# Altium project NRF_RHD2132_1813_YBW.PrjPcb
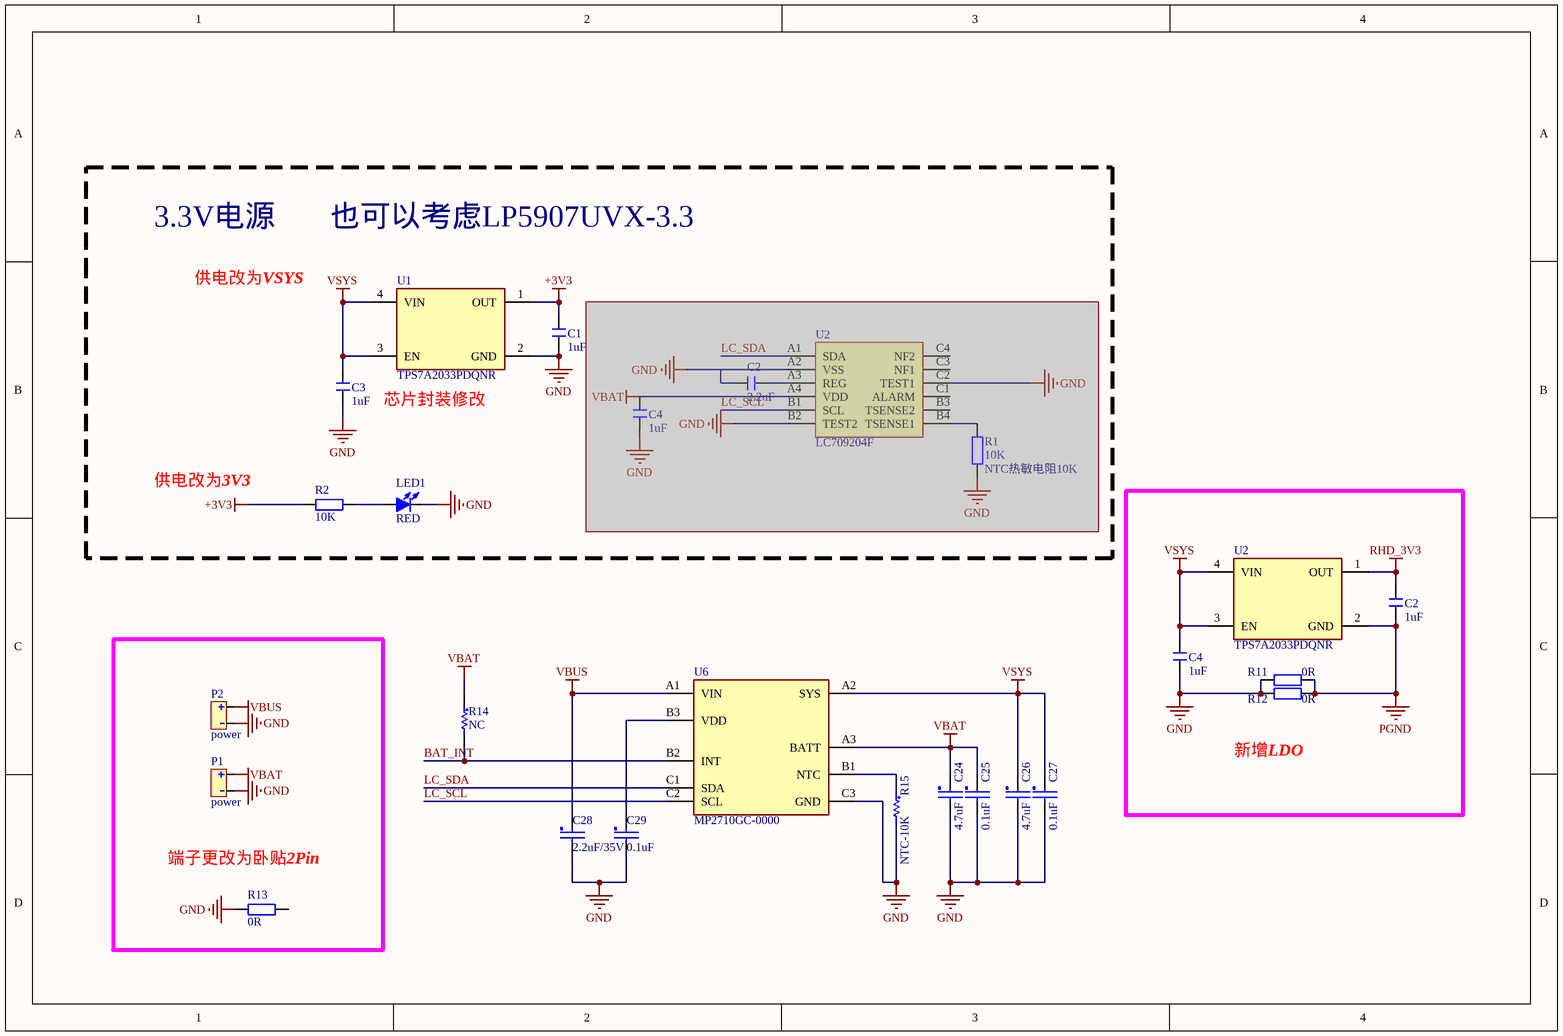
[diagram p0: Power.SchDoc]
4 sheets, 62 parts. Net scope: global (net labels, ports and power ports of the same name join across sheets).
Board file: rhd2132_20250418.PcbDoc
Sheets:
  Power.SchDoc
  rhd2132.SchDoc
  IMU.SchDoc
  nrf52840_wlcsp.SchDoc

## Sheet Power.SchDoc
size A4

### Parts
(Parts that share a designator on the sheet are numbered #1, #2 ... from top to bottom, then left to right.)
C1  1uF  [C 0201_L]
C2#1  2.2uF  [C 0201_L]  (masked out: inside a compile mask, not in the netlist)
C2#2  1uF  [C 0201_L]
C3  1uF  [C 0201_L]
C4#1  1uF  [C 0201_L]  (masked out: inside a compile mask, not in the netlist)
C4#2  1uF  [C 0201_L]
C24  4.7uF  [0201(C)]
C25  0.1uF  [0201(C)]
C26  4.7uF  [0201(C)]
C27  0.1uF  [0201(C)]
C28  2.2uF/35V  [0201(C)]
C29  0.1uF  [0201(C)]
LED1  RED  [LED-SMD_L0.7-W0.4-RD_BLUE - duplicate]
P1  power  [CONN-SMD_SM02B-SURS-TF-LF-SN - duplicate]
P2  power  [HDR-SMD_2P-P1.27-V-M-LS4.2-R1]
R1  10K  BOM名称: NTC热敏电阻10K  [R0201]  (masked out: inside a compile mask, not in the netlist)
R2  10K  [R 0201_L]
R11  0R  [R 0201_L]
R12  0R  [R 0201_L]
R13  0R  [0402(R)]
R14  NC  [0201(R)]  (no BOM)
R15  NTC-10K  [0201(R)]
U1  TPS7A2033PDQNR  [X2SON-0.4]
U2#1  LC709204F  [WLCSP-12_L2.0-W1.5-R3-C4-P0.40-TL]  (masked out: inside a compile mask, not in the netlist)
U2#2  TPS7A2033PDQNR  [X2SON-0.4]
U6  MP2710GC-0000  [WLCSP3*3-P0.5mm]

### Blocks framed on the sheet
新增LDO: C2#2 C4#2 R11 R12 U2#2
端子更改为卧贴2Pin: P1 P2 R13

### Nets
+3V3: C1.2 R2.1 U1.1(OUT)
GND: C1.1 C3.1 C4#2.1 C24.2 C25.2 C26.2 C27.2 C28.2 C29.2 LED1.2(K) P1.1(-) P2.1(-) R11.1 R12.1 R13.1 R15.2 U1.2(GND) U6.C3(GND)
PGND: C2#2.1 R11.2 R12.2 U2#2.2(GND)
RHD_3V3: C2#2.2 U2#2.1(OUT)
VBAT: C24.1 C25.1 P1.2(+) R14.1 U6.A3(BATT)
VBUS: C28.1 P2.2(+) U6.A1(VIN)
VSYS: C3.2 C4#2.2 C26.1 C27.1 U1.3(EN) U1.4(VIN) U2#2.3(EN) U2#2.4(VIN) U6.A2(SYS)
BAT_INT: R14.2 U6.B2(INT)
LC_SCL: U6.C2(SCL)
LC_SDA: U6.C1(SDA)
NetC29_1: C29.1 U6.B3(VDD)
NetLED1_1: LED1.1(A) R2.2
NetR15_1: R15.1 U6.B1(NTC)

Not connected (* = marked no-connect by the designer): R13 2

### Notes on the sheet
- 3.3V电源
- 也可以考虑LP5907UVX-3.3
- 供电改为VSYS
- 芯片封装修改
- 供电改为3V3

### Library data of the parts
C1 C2#1 C2#2 C3 C4#1 C4#2 = C: 贴片电容; BOM名称: 无极性贴片电容
  C1 C2#2 C3 C4#2: Value: 1uF
  C2#1: value: 2.2uF
  C4#1: value: 1uF
C24-C29 = CAP
LED1 = LED-SMD: 贴片LED; BOM名称: 贴片LED; Color: RED
R1 = R: NTC热敏电阻 10K; Value: 10K
R2 = R: 贴片电阻; BOM名称: 贴片电阻; Value: 10K
R11 R12 = R: 贴片电阻; Value: 10K; BOM名称: 贴片电阻
R13 = R: 贴片电阻 OR; Value: 10K; BOM名称: 贴片电阻
R14 R15 = Res Semi: Semiconductor Resistor; Value: 100; Published: 8-Jun-2000; LatestRevisionDate: 17-Jul-2002; LatestRevisionNote: Re-released for DXP Platform.; PackageReference: AXIAL-0.5; Publisher: Altium Limited; PackageDescription: Axial Device, Thru-Hole; 2 Leads; 0.5 in Pin Spacing
U1 U2#2 = IC_TPS7A2033PDQNR: TPS7A2033PDQNR/X2SON
U2#1 = LC709203F
U6 = MP2710

## Sheet rhd2132.SchDoc
size A4
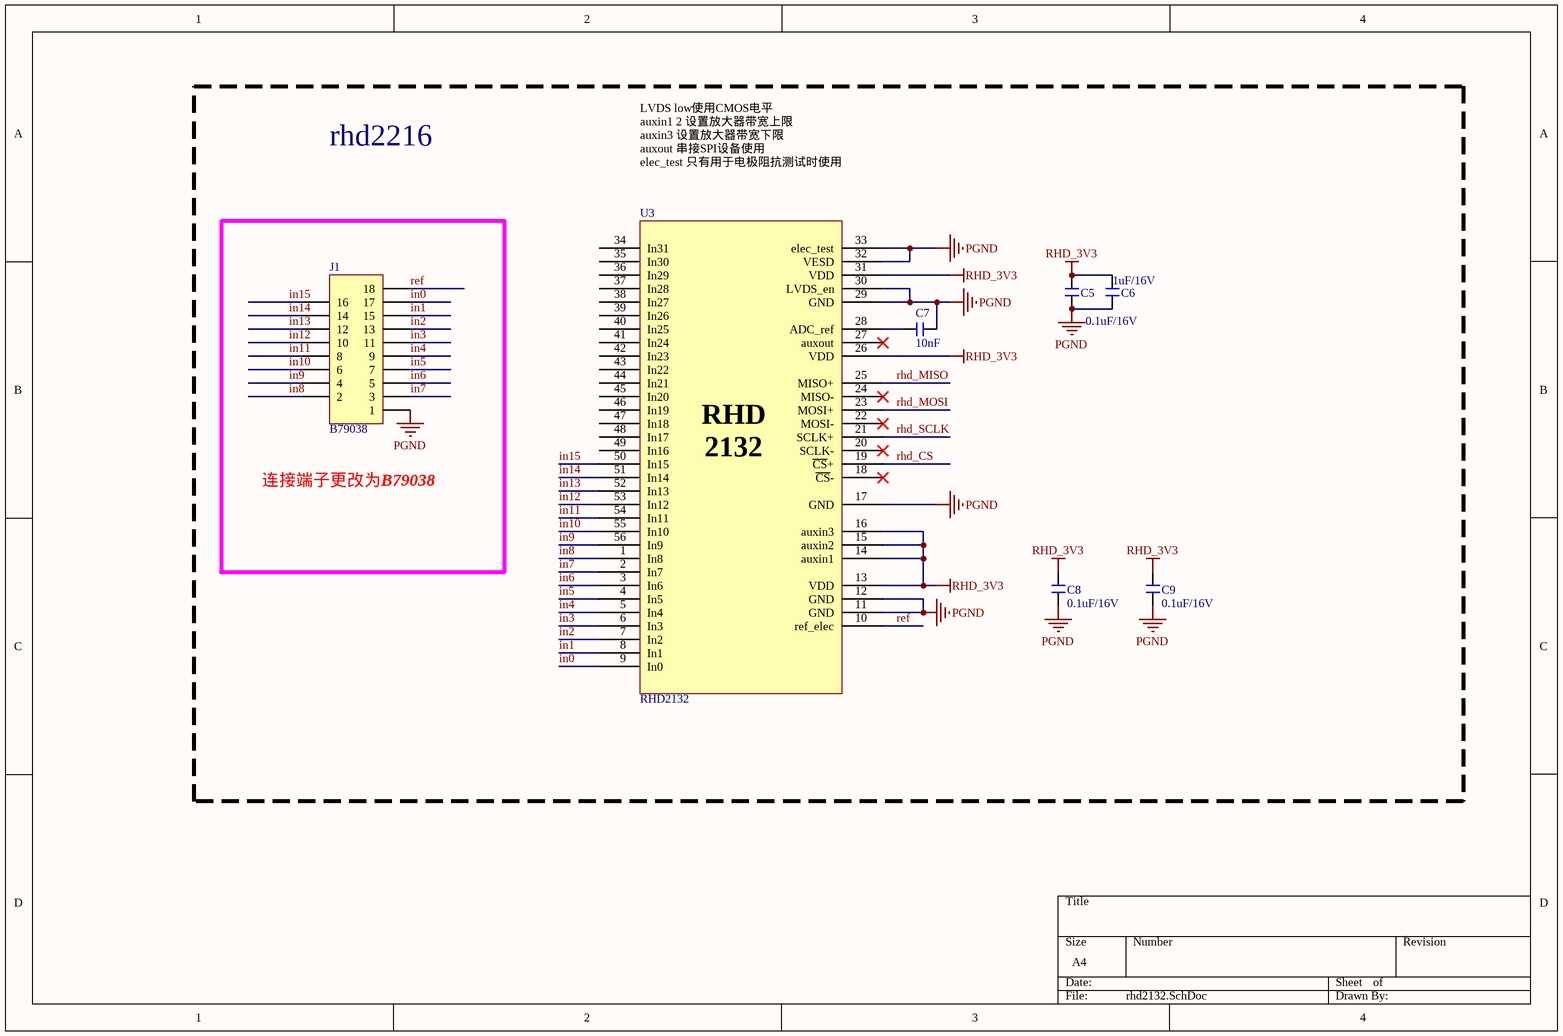
[diagram p1: rhd2132.SchDoc]

### Parts
C5  0.1uF/16V  [C 0201_L]
C6  1uF/16V  [C 0201_L]
C7  10nF  [C 0201_L]
C8  0.1uF/16V  [C 0201_L]
C9  0.1uF/16V  [C 0201_L]
J1  B79038  [B79038]
U3  RHD2132  [QFN-56-9mm]

### Blocks framed on the sheet
rhd2216: C5-C9 U3
连接端子更改为B79038: J1

### Nets
PGND: C5.1 C6.1 C7.2 C8.1 C9.1 J1.1 U3.11(GND) U3.12(GND) U3.17(GND) U3.29(GND) U3.30(LVDS_en) U3.32(VESD) U3.33(elec_test)
RHD_3V3: C5.2 C6.2 C8.2 C9.2 U3.13(VDD) U3.14(auxin1) U3.15(auxin2) U3.16(auxin3) U3.26(VDD) U3.31(VDD)
in0: J1.17 U3.9(In0)
in1: J1.15 U3.8(In1)
in2: J1.13 U3.7(In2)
in3: J1.11 U3.6(In3)
in4: J1.9 U3.5(In4)
in5: J1.7 U3.4(In5)
in6: J1.5 U3.3(In6)
in7: J1.3 U3.2(In7)
in8: J1.2 U3.1(In8)
in9: J1.4 U3.56(In9)
in10: J1.6 U3.55(In10)
in11: J1.8 U3.54(In11)
in12: J1.10 U3.53(In12)
in13: J1.12 U3.52(In13)
in14: J1.14 U3.51(In14)
in15: J1.16 U3.50(In15)
ref: J1.18 U3.10(ref_elec)
rhd_CS: U3.19(~{CS}+)
rhd_MISO: U3.25(MISO+)
rhd_MOSI: U3.23(MOSI+)
rhd_SCLK: U3.21(SCLK+)
NetC7_1: C7.1 U3.28(ADC_ref)

Not connected (* = marked no-connect by the designer): U3 18(~{CS}-)* 20(SCLK-)* 22(MOSI-)* 24(MISO-)* 27(auxout)* 34(In31) 35(In30) 36(In29) 37(In28) 38(In27) 39(In26) 40(In25) 41(In24) 42(In23) 43(In22) 44(In21) 45(In20) 46(In19) 47(In18) 48(In17) 49(In16)

### Notes on the sheet
- LVDS low使用CMOS电平
  auxin1 2 设置放大器带宽上限
  auxin3 设置放大器带宽下限
  auxout 串接SPI设备使用
  elec_test 只有用于电极阻抗测试时使用
  接地电极布于四周
- (in symbol RHD2132) RHD / 2132

### Library data of the parts
C5-C9 = C: 贴片电容; BOM名称: 无极性贴片电容
  C5 C8 C9: Value: 0.1uF/16V
  C6: Value: 1uF/16V
  C7: Value: 10nF
J1 = CON_A79015-001-18PIN: LatestRevisionDate: 17-Jul-2002; LatestRevisionNote: Re-released for DXP Platform.; Publisher: Altium Limited

## Sheet IMU.SchDoc
size A4
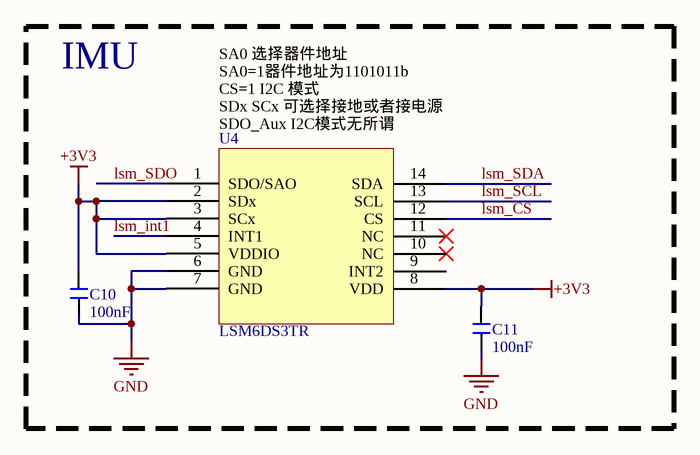
[diagram p2: IMU.SchDoc]

### Parts
C10  100nF  [C 0201_L]
C11  100nF  [C 0201_L]
U4  LSM6DS3TR  [LAG-14]

### Blocks framed on the sheet
IMU: C10 C11 U4

### Nets
+3V3: C10.2 C11.2 U4.2(SDx) U4.3(SCx) U4.5(VDDIO) U4.8(VDD)
GND: C10.1 C11.1 U4.6(GND) U4.7(GND)
lsm_CS: U4.12(CS)
lsm_int1: U4.4(INT1)
lsm_SCL: U4.13(SCL)
lsm_SDA: U4.14(SDA)
lsm_SDO: U4.1(SDO/SAO)

Not connected (* = marked no-connect by the designer): U4 9(INT2) 10(NC)* 11(NC)*

### Notes on the sheet
- (near U4) SA0 选择器件地址
  SA0=1器件地址为1101011b
  CS=1 I2C 模式
  SDx SCx 可选择接地或者接电源
  SDO_Aux I2C模式无所谓

### Library data of the parts
C10 C11 = C: 贴片电容; BOM名称: 无极性贴片电容; value: 100nF

## Sheet nrf52840_wlcsp.SchDoc
size A3
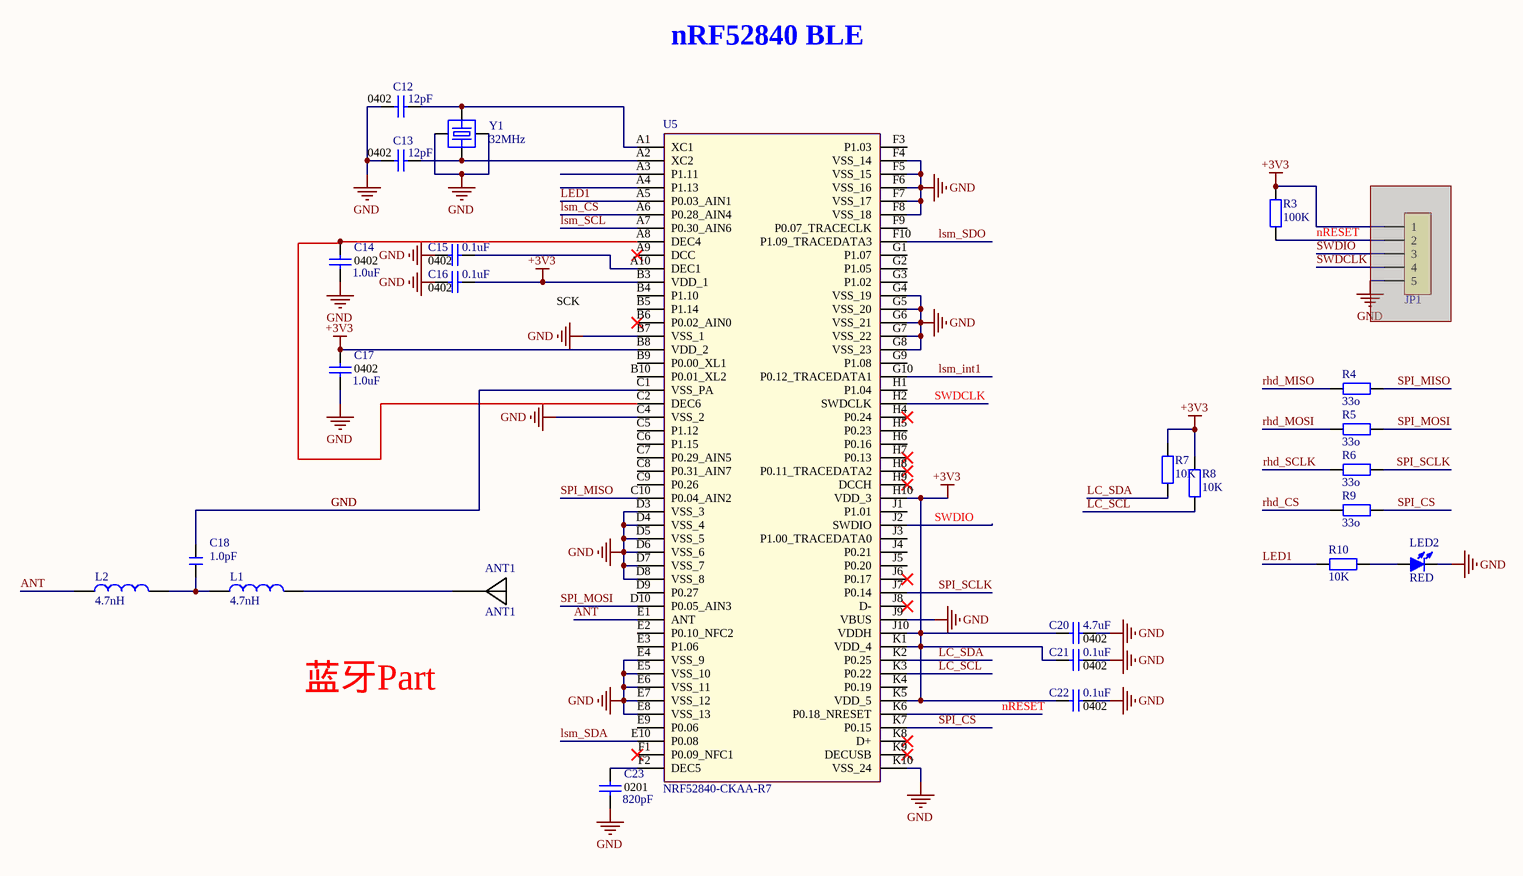
[diagram p3: nrf52840_wlcsp.SchDoc]

### Parts
ANT1  ANT1  [ANT-SMD_2P-L3.20-W1.60]
C12  12pF  Package: 0402  [C 0201_L]
C13  12pF  Package: 0402  [C 0201_L]
C14  1.0uF  Package: 0402  [C 0201_L]
C15  0.1uF  Package: 0402  [C 0201_L]
C16  0.1uF  Package: 0402  [C 0201_L]
C17  1.0uF  Package: 0402  [C 0201_L]
C18  1.0pF  [C 0201_L]
C20  4.7uF  Package: 0402  [C 0201_L]
C21  0.1uF  Package: 0402  [C 0201_L]
C22  0.1uF  Package: 0402  [C 0201_L]
C23  820pF  Package: 0201  [C 0201_L]
JP1  HDR-1X5  [FPC_05P-0.5mm-RA-SMD]  (value not drawn)  (masked out: inside a compile mask, not in the netlist)
L1  4.7nH  [L0201]
L2  4.7nH  [L0201]
LED2  RED  [LED-SMD_L0.7-W0.4-RD_BLUE - duplicate]
R3  100K  [R 0201_L]
R4  33o  [R 0201_L]
R5  33o  [R 0201_L]
R6  33o  [R 0201_L]
R7  10K  [R 0201_L]
R8  10K  [R 0201_L]
R9  33o  [R 0201_L]
R10  10K  [R 0201_L]
U5  NRF52840-CKAA-R7  [BGA94C35P10X10_354X361X51]
Y1  32MHz  [OSC 1612-4P]

### Nets
+3V3: C16.1 C17.1 C20.2 C21.2 C22.2 R3.2 R7.2 R8.2 U5.B3(VDD_1) U5.B8(VDD_2) U5.H10(VDD_3) U5.J10(VDDH) U5.K1(VDD_4) U5.K5(VDD_5)
GND: C12.2 C13.2 C14.2 C15.2 C16.2 C17.2 C18.1 C20.1 C21.1 C22.1 C23.2 LED2.2(K) U5.B7(VSS_1) U5.C1(VSS_PA) U5.C4(VSS_2) U5.D3(VSS_3) U5.D4(VSS_4) U5.D5(VSS_5) U5.D6(VSS_6) U5.D7(VSS_7) U5.D8(VSS_8) U5.E4(VSS_9) U5.E5(VSS_10) U5.E6(VSS_11) U5.E7(VSS_12) U5.E8(VSS_13) U5.F4(VSS_14) U5.F5(VSS_15) U5.F6(VSS_16) U5.F7(VSS_17) U5.F8(VSS_18) U5.G4(VSS_19) U5.G5(VSS_20) U5.G6(VSS_21) U5.G7(VSS_22) U5.G8(VSS_23) U5.J9(VBUS) U5.K10(VSS_24) Y1.2(GND) Y1.4(GND)
ANT: L2.1 U5.E1(ANT)
LC_SCL: R8.1 U5.K3(P0.22)
LC_SDA: R7.1 U5.K2(P0.25)
LED1: R10.1 U5.A5(P0.03_AIN1)
lsm_CS: U5.A6(P0.28_AIN4)
lsm_int1: U5.G10(P0.12_TRACEDATA1)
lsm_SCL: U5.A7(P0.30_AIN6)
lsm_SDA: U5.E10(P0.08)
lsm_SDO: U5.F10(P1.09_TRACEDATA3)
nRESET: R3.1 U5.K6(P0.18_NRESET)
rhd_CS: R9.1
rhd_MISO: R4.1
rhd_MOSI: R5.1
rhd_SCLK: R6.1
SPI_CS: R9.2 U5.K7(P0.15)
SPI_MISO: R4.2 U5.C10(P0.04_AIN2)
SPI_MOSI: R5.2 U5.D10(P0.05_AIN3)
SPI_SCLK: R6.2 U5.J7(P0.14)
SWDCLK: U5.H2(SWDCLK)
SWDIO: U5.J2(SWDIO)
NetANT1_1: ANT1.1 L1.2
NetC12_1: C12.1 U5.A1(XC1) Y1.1(I/O)
NetC13_1: C13.1 U5.A2(XC2) Y1.3(O/I)
NetC14_1: C14.1 U5.A8(DEC4) U5.C2(DEC6)
NetC15_1: C15.1 U5.A10(DEC1)
NetC18_2: C18.2 L1.1 L2.2
NetC23_1: C23.1 U5.F2(DEC5)
NetLED2_1: LED2.1(A) R10.2

Not connected (* = marked no-connect by the designer): U5 A3(P1.11) A4(P1.13) A9(DCC)* B4(P1.10) B5(P1.14) B6(P0.02_AIN0)* B9(P0.00_XL1) B10(P0.01_XL2) C5(P1.12) C6(P1.15) C7(P0.29_AIN5) C8(P0.31_AIN7) C9(P0.26) D9(P0.27) E2(P0.10_NFC2) E3(P1.06) E9(P0.06) F1(P0.09_NFC1)* F3(P1.03) F9(P0.07_TRACECLK) G1(P1.07) G2(P1.05) G3(P1.02) G9(P1.08) H1(P1.04) H4(P0.24)* H5(P0.23) H6(P0.16) H7(P0.13)* H8(P0.11_TRACEDATA2)* H9(DCCH)* J1(P1.01) J3(P1.00_TRACEDATA0) J4(P0.21) J5(P0.20) J6(P0.17)* J8(D-)* K4(P0.19) K8(D+)* K9(DECUSB)*

### Notes on the sheet
- nRF52840 BLE
- 蓝牙Part
- Labels drawn without touching a wire or pin: SCK

### Library data of the parts
ANT1 = ANT1: PCB板载天线; 版权归属: 封装库来自淘宝 ID：黄晶宝石; BOM名称: PCB板载天线; 技术支持，联系售后: https://shop463601444.taobao.com
C12 C13 = CAP CER 12PF 50V C0G/NP0 0402: Manufacturer Part Number: CC0402GRNPO9BN120; Manufacturer: YAGEO; Supplier Part Number 1: 311-3609-1-ND; Height: 0.55mm; Supplier 1: Digi-Key; value: 12pF
C14 C17 = CAP CER 1UF 16V X7R 0603: Manufacturer Part Number: C0603C105K4RAC7867; Manufacturer: KEMET; Supplier Part Number 1: 399-C0603C105K4RAC7867CT-ND; Height: 0.9mm; Supplier 1: Digi-Key; value: 1.0uF
C15 C16 C21 C22 = CAP CER 0.1UF 6.3V X7R 0201: Manufacturer Part Number: CC0201KRX7R5BB104; Manufacturer: YAGEO; Supplier Part Number 1: 13-CC0201KRX7R5BB104CT-ND; Height: 0.33mm; Supplier 1: Digi-Key; value: 0.1uF
C18 = C: 贴片电容; BOM名称: 无极性贴片电容; value: 1.0pF
C20 = CAP CER 4.7UF 6.3V X7R 0603: Manufacturer Part Number: JMK107BB7475KA-T; Manufacturer: Taiyo Yuden; Supplier Part Number 1: 587-5870-1-ND; Height: 1.0mm; Supplier 1: Digi-Key; value: 4.7uF
C23 = CAP CER 820PF 25V X7R 0201: Manufacturer Part Number: CC0201KRX7R8BB821; Manufacturer: YAGEO; Supplier Part Number 1: 311-3698-1-ND; Height: 0.33mm; Supplier 1: Digi-Key; value: 820pF
JP1 = Header 5: 5P接插件; 学习资源: 封装库来自淘宝 ID：黄晶宝石; BOM名称: 5P接插件; 联系售后: https://shop463601444.taobao.com
L1 L2 = L: 小功率贴片电感; BOM名称: 小功率贴片电感; Value: 4.7nH
LED2 = LED-SMD: 贴片LED; BOM名称: 贴片LED; Color: RED
R3-R10 = R: 贴片电阻; BOM名称: 贴片电阻
  R3: Value: 100K
  R4-R6 R9: Value: 33o
  R7 R8 R10: Value: 10K
U5 = NRF52840-CKAA-R7: Advanced Bluetooth 5, Thread and Zigbee multiprotocol SoC; Manufacturer: Nordic Semiconductor; Supplier 1: Mouser; Manufacturer Part Number: NRF52840-CKAA-R7; RoHS: Yes; Category: RF Receivers, Transceivers; Pricing 1: 1=6.69000, 10=6.04000, 50=5.76000, 100=5.00000, 1000=5.00000, 10000=5.00000 (USD); Supplier Part Number 1: 949-NRF52840-CKAA-R7
Y1 = XTAL_ECS-320-8-37BQ-CKY-TR: Crystal 32MHz 8pF ±10ppm ±10ppm 4-Pin Miniature CSMD T/R; Manufacturer: ECS International; Supplier 1: Digi-Key; Manufacturer Part Number: ECS-320-8-37BQ-CKY-TR; RoHS: No; Stock 1: 8978; Pricing 1: 1=0.57000, 10=0.47700, 50=0.42960, 100=0.38180, 500=0.36270 (USD); Supplier Part Number 1: 50-ECS-320-8-37BQ-CKY-CT-ND

## Nets that join several sheets
+3V3: Power (C1.2 R2.1 U1.1), IMU (6 pins), nrf52840_wlcsp (14 pins)
GND: Power (18 pins), IMU (C10.1 C11.1 U4.6 U4.7), nrf52840_wlcsp (40 pins)
PGND: Power (C2#2.1 R11.2 R12.2 U2#2.2), rhd2132 (13 pins)
RHD_3V3: Power (C2#2.2 U2#2.1), rhd2132 (10 pins)
LC_SCL: Power (U6.C2), nrf52840_wlcsp (R8.1 U5.K3)
LC_SDA: Power (U6.C1), nrf52840_wlcsp (R7.1 U5.K2)
lsm_CS: IMU (U4.12), nrf52840_wlcsp (U5.A6)
lsm_int1: IMU (U4.4), nrf52840_wlcsp (U5.G10)
lsm_SCL: IMU (U4.13), nrf52840_wlcsp (U5.A7)
lsm_SDA: IMU (U4.14), nrf52840_wlcsp (U5.E10)
lsm_SDO: IMU (U4.1), nrf52840_wlcsp (U5.F10)
rhd_CS: rhd2132 (U3.19), nrf52840_wlcsp (R9.1)
rhd_MISO: rhd2132 (U3.25), nrf52840_wlcsp (R4.1)
rhd_MOSI: rhd2132 (U3.23), nrf52840_wlcsp (R5.1)
rhd_SCLK: rhd2132 (U3.21), nrf52840_wlcsp (R6.1)